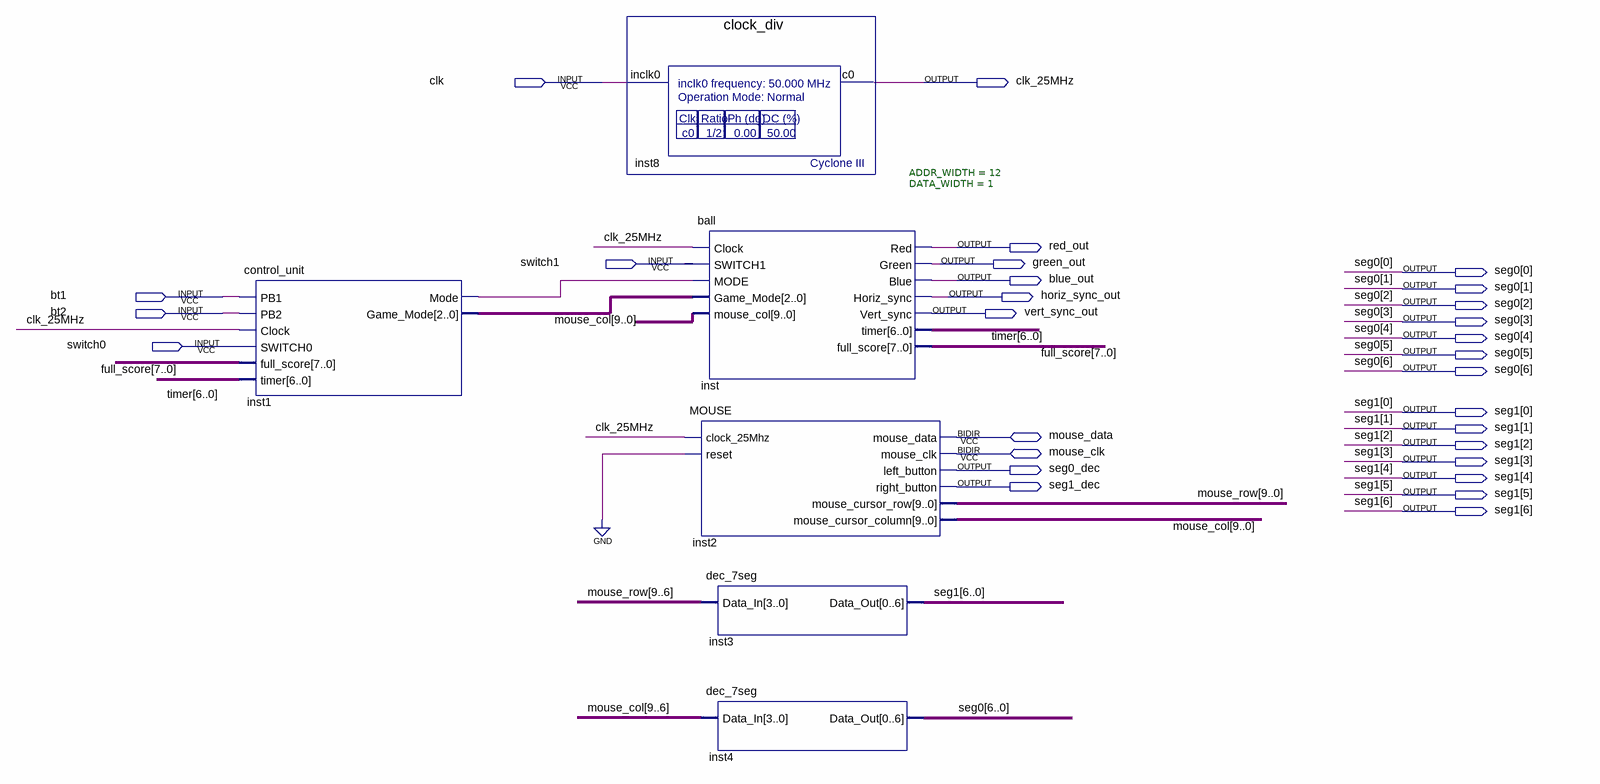
[diagram p0: schematic sheet]
// Quartus schematic ball_display.bdf as structural Verilog: 6 symbols, 29 pins
module ball_display (
  input  clk,
  input  switch1,
  input  bt1,
  input  bt2,
  input  switch0,
  inout  mouse_data,
  inout  mouse_clk,
  output clk_25MHz,
  output red_out,
  output green_out,
  output [6:0] seg0,
  output blue_out,
  output horiz_sync_out,
  output vert_sync_out,
  output [6:0] seg1,
  output seg0_dec,
  output seg1_dec
);

  wire inst1_mode;
  wire [2:0] inst1_game_mode;
  wire [6:0] timer;
  wire [7:0] full_score;
  wire [9:0] mouse_col, mouse_row;

  control_unit inst1 (
    .PB1(bt1), .PB2(bt2), .Clock(clk_25MHz), .SWITCH0(switch0), .full_score(full_score), .timer(timer),
    .Mode(inst1_mode), .Game_Mode(inst1_game_mode));
  clock_div inst8 (.inclk0(clk), .c0(clk_25MHz));
  ball #(.ADDR_WIDTH(12), .DATA_WIDTH(1)) inst (
    .Clock(clk_25MHz), .SWITCH1(switch1), .MODE(inst1_mode), .Game_Mode(inst1_game_mode),
    .mouse_col(mouse_col), .Red(red_out), .Green(green_out), .Blue(blue_out), .Horiz_sync(horiz_sync_out),
    .Vert_sync(vert_sync_out), .timer(timer), .full_score(full_score));
  MOUSE inst2 (
    .clock_25Mhz(clk_25MHz), .reset(1'b0), .left_button(seg0_dec), .right_button(seg1_dec),
    .mouse_cursor_row(mouse_row), .mouse_cursor_column(mouse_col), .mouse_data(mouse_data),
    .mouse_clk(mouse_clk));
  dec_7seg inst3 (.Data_In(mouse_row[9:6]), .Data_Out(seg1));
  dec_7seg inst4 (.Data_In(mouse_col[9:6]), .Data_Out(seg0));
endmodule
